# Altium schematic sheet Scratchpad.SchDoc (part 1 of 3)
size A
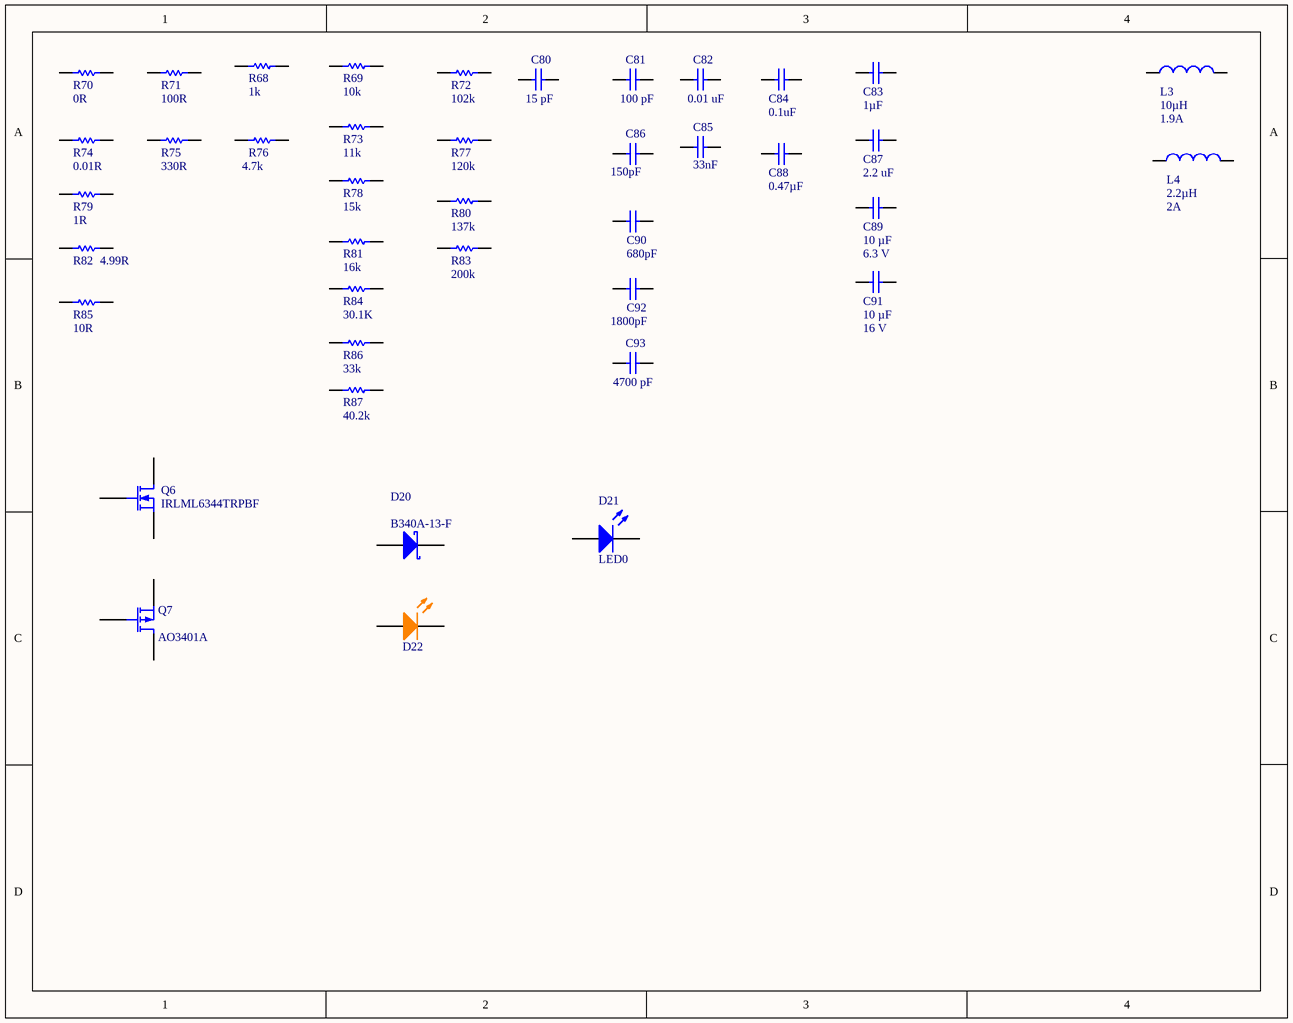
[diagram p0: Scratchpad.SchDoc]

## Parts
C80  Capacitance: 15 pF  [0402C]  (hidden comment: 50V)
C81  Capacitance: 100 pF  [0402C]  (hidden comment: 50V)
C82  Capacitance: 0.01 uF  [0402C]  (hidden comment: 50V)
C83  Capacitance: 1µF  [0402C]  (hidden comment: 50V)
C84  Capacitance: 0.1uF  [0402C]  (hidden comment: 50V)
C85  Capacitance Value: 33nF  [0402C]  (hidden comment: 50V)
C86  Capacitance: 150pF  [0402C]  (hidden comment: 50V)
C87  Capacitance Value: 2.2 uF  [0402C]  (hidden comment: 50V)
C88  Capacitance: 0.47µF  [0402C]  (hidden comment: 50V)
C89  Capacitance: 10 µF  Rated Voltage: 6.3 V  [0603C]  (hidden comment: 50V)
C90  Capacitance: 680pF  [0402C]  (hidden comment: 50V)
C91  Nominal voltage: 16 V  Capacity (elec.): 10 µF  [1206C]  (hidden comment: 50V)
C92  Capacitance: 1800pF  [0402C]  (hidden comment: 50V)
C93  Capacitance: 4700 pF  [0402C]  (hidden comment: 50V)
D20  Manufacturer Part Number: B340A-13-F  [SMA]  (hidden comment: BAT46ZFILM)
D21  LED0  [LED-0]
D22  LED0_1  [0402L-ORANGE]  (value not drawn)
L3  Inductance: 10µH  Current - Saturation: 1.9A  [NR6028T100M]  (hidden comment: Inductor)
L4  Inductance: 2.2µH  Current - Saturation: 2A  [NR6028T100M]  (hidden comment: Inductor)
Q6  Manufacturer Part Number: IRLML6344TRPBF  [SOT-23]  (hidden comment: MOSFET-N)
Q7  Manufacturer Part Number: AO3401A  [SOT-23]
R68  Resistance (Ohms): 1k  [0402R]  (hidden comment: Res 0805)
R69  Resistance: 10k  [0402R]  (hidden comment: Res 0805)
R70  Resistance (Ohms): 0R  [0402R]  (hidden comment: Res 0805)
R71  Resistance: 100R  [0402R]  (hidden comment: Res 0805)
R72  Resistance: 102k  [0402R]  (hidden comment: Res 0805)
R73  Resistance: 11k  [0402R]  (hidden comment: Res 0805)
R74  Resistance (Ohms): 0.01R  [0402R]  (hidden comment: Res 0805)
R75  Resistance: 330R  [0402R]  (hidden comment: Res 0805)
R76  Resistance Value: 4.7k  [0402R]  (hidden comment: Res 0805)
R77  Resistance: 120k  [0402R]  (hidden comment: Res 0805)
R78  Resistance: 15k  [0402R]  (hidden comment: Res 0805)
R79  Resistance: 1R  [0402R]  (hidden comment: Res 0805)
R80  Resistance (Ohms): 137k  [0402R]  (hidden comment: Res 0805)
R81  Resistance: 16k  [0402R]  (hidden comment: Res 0805)
R82  Resistance: 4.99R  [0402R]  (hidden comment: Res 0805)
R83  Resistance: 200k  [0402R]  (hidden comment: Res 0805)
R84  Resistance: 30.1K  [0402R]  (hidden comment: Res 0805)
R85  Resistance: 10R  [0402R]  (hidden comment: Res 0805)
R86  Resistance Value: 33k  [0402R]  (hidden comment: Res 0805)
R87  Resistance: 40.2k  [0402R]  (hidden comment: Res 0805)

## Nets

Not connected (* = marked no-connect by the designer): C80 1 2; C81 1 2; C82 1 2; C83 1 2; C84 1 2; C85 1 2; C86 1 2; C87 1 2; C88 1 2; C89 1 2; C90 1 2; C91 1 2; C92 1 2; C93 1 2; D20 1(A) 2(K); D21 1(A) 2(K); D22 1(A) 2(K); L3 1 2; L4 1 2; Q6 1(G) 2(S) 3(D); Q7 1(G) 2(S) 3(D); R68 1 2; R69 1 2; R70 1 2; R71 1 2; R72 1 2; R73 1 2; R74 1 2; R75 1 2; R76 1 2; R77 1 2; R78 1 2; R79 1 2; R80 1 2; R81 1 2; R82 1 2; R83 1 2; R84 1 2; R85 1 2; R86 1 2; R87 1 2